# Altium schematic sheet power.SchDoc
size A4
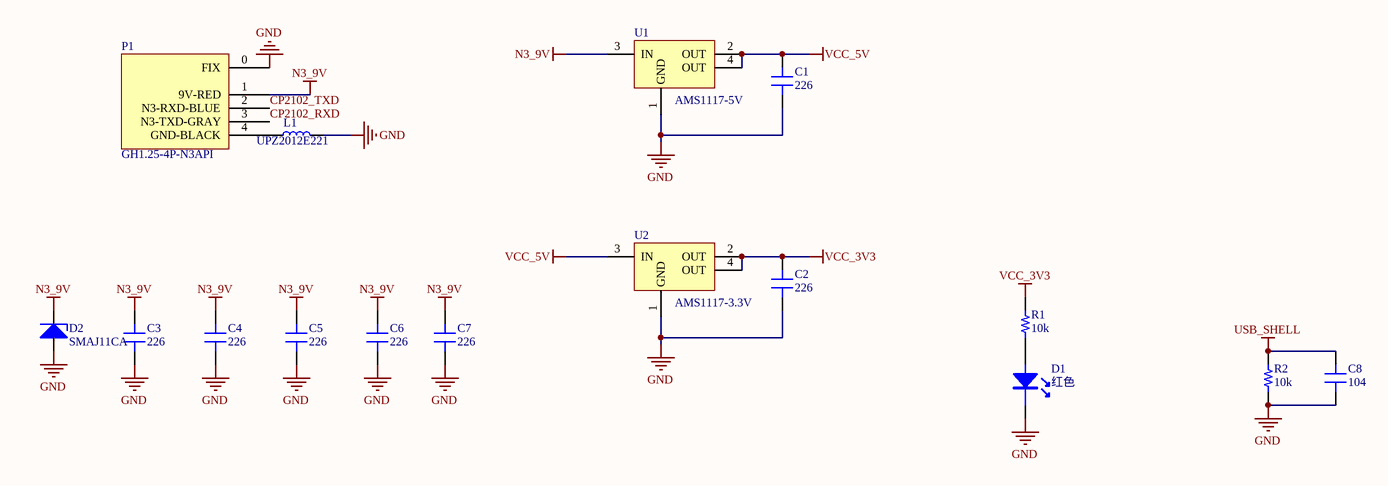
[diagram p0: power.SchDoc]

## Parts
C1  226  [C0603/1608]
C2  226  [C0603/1608]
C3  226  [C1206/3216]
C4  226  [C1206/3216]
C5  226  [C1206/3216]
C6  226  [C1206/3216]
C7  226  [C1206/3216]
C8  104  [C0603/1608]
D1  Color: 红色  [LED0603-蓝色]  (hidden comment: LED-红色)
D2  SMAJ11CA  [DO-214AC/SMA]
L1  UPZ2012E221  [L0805/2012]
P1  GH1.25-4P-N3API  [GH1.25-4P（卧贴）]
R1  10k  [R0603/1608]
R2  10k  [R0603/1608]
U1  AMS1117-5V  [SOT-223]
U2  AMS1117-3.3V  [SOT-223]

## Nets
GND: C1.1 C2.1 C3.1 C4.1 C5.1 C6.1 C7.1 C8.1 D1.2(K) D2.1(+) L1.1 P1.0(FIX) R2.1 U1.1(GND) U2.1(GND)
N3_9V: C3.2 C4.2 C5.2 C6.2 C7.2 D2.2(-) P1.1(9V-RED) U1.3(IN)
USB_SHELL: C8.2 R2.2
VCC_3V3: C2.2 R1.2 U2.2(OUT) U2.4(OUT)
VCC_5V: C1.2 U1.2(OUT) U1.4(OUT) U2.3(IN)
CP2102_RXD: P1.3(N3-TXD-GRAY)
CP2102_TXD: P1.2(N3-RXD-BLUE)
NetD1_1: D1.1(A) R1.1
NetL1_2: L1.2 P1.4(GND-BLACK)

## Library data of the parts
C1-C8 = 陶瓷电容
D1 = LED: 发光二极管
D2 = 瞬态抑制二极管
L1 = 磁珠: 贴片磁珠
R1 R2 = 电阻
U1 U2 = AMS1117: AMS1117低压差线性稳压器